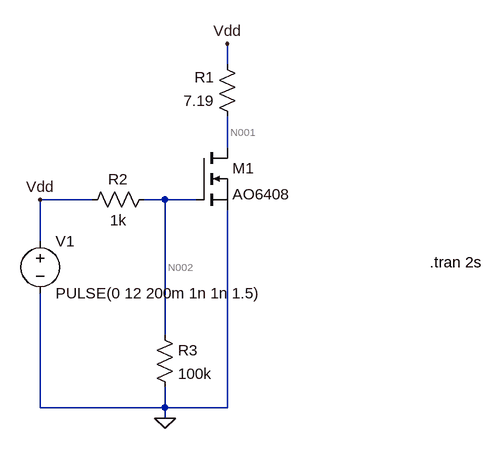
[diagram p0: schematic Valve Controller.asc]
Valve Controller.asc, the LTspice schematic file:
Version 4
SHEET 1 880 680
WIRE 320 -160 320 -192
WIRE 320 -32 320 -80
WIRE 112 48 32 48
WIRE 224 48 192 48
WIRE 272 48 224 48
WIRE 32 112 32 48
WIRE 224 256 224 48
WIRE 32 368 32 192
WIRE 224 368 224 336
WIRE 224 368 32 368
WIRE 320 368 320 64
WIRE 320 368 224 368
WIRE 224 384 224 368
FLAG 320 -192 Vdd
FLAG 32 48 Vdd
FLAG 224 384 0
SYMBOL voltage 32 96 R0
WINDOW 123 0 0 Left 0
WINDOW 39 0 0 Left 0
SYMATTR InstName V1
SYMATTR Value PULSE(0 12 200m 1n 1n 1.5)
SYMBOL nmos 272 -32 R0
SYMATTR InstName M1
SYMATTR Value AO6408
SYMBOL res 336 -64 R180
WINDOW 0 36 76 Left 2
WINDOW 3 36 40 Left 2
SYMATTR InstName R1
SYMATTR Value 7.19
SYMBOL res 208 32 R90
WINDOW 0 0 56 VBottom 2
WINDOW 3 32 56 VTop 2
SYMATTR InstName R2
SYMATTR Value 1k
SYMBOL res 208 240 R0
SYMATTR InstName R3
SYMATTR Value 100k
TEXT 632 144 Left 2 !.tran 2s

The netlist it stands for:
* Valve Controller.asc
V1 Vdd 0 PULSE(0 12 200m 1n 1n 1.5)
M1 N001 N002 0 0 AO6408
R1 N001 Vdd 7.19
R2 N002 Vdd 1k
R3 N002 0 100k
.model NMOS NMOS
.model PMOS PMOS
.lib standard.mos
.tran 2s
.backanno
.end

* Results of the author's LTspice run, read from the files saved beside the schematic
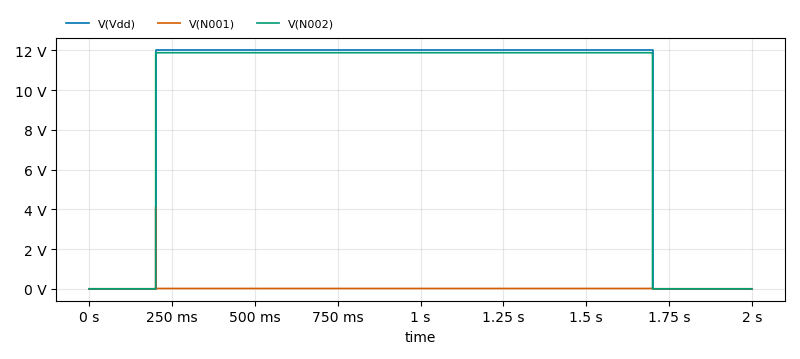
[diagram p1: Transient Analysis of Valve Controller.asc, plotted from the saved traces]
* Transient Analysis, 1 run:
*   V(Vdd): min 0 V, max 12 V, average 9 V, rms 10.39 V, last 0 V
*   V(N001): min -1.187 mV, max 4.108 V, average 11.78 mV, rms 13.62 mV, last 0 V
*   V(N002): min 0 V, max 11.88 V, average 8.911 V, rms 10.29 V, last 0 V